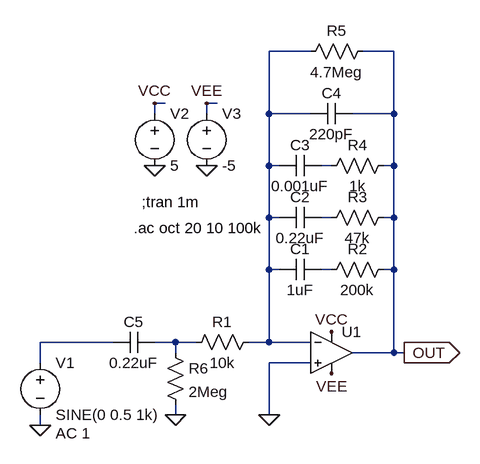
[diagram p0: schematic pink_noise2.asc]
pink_noise2.asc, the LTspice schematic file:
Version 4
SHEET 1 880 680
WIRE 368 -352 304 -352
WIRE 496 -352 448 -352
WIRE 144 -272 128 -272
WIRE 224 -272 208 -272
WIRE 128 -256 128 -272
WIRE 208 -256 208 -272
WIRE 304 -256 304 -352
WIRE 368 -256 304 -256
WIRE 496 -256 496 -352
WIRE 496 -256 432 -256
WIRE 304 -176 304 -256
WIRE 320 -176 304 -176
WIRE 400 -176 384 -176
WIRE 496 -176 496 -256
WIRE 496 -176 480 -176
WIRE 304 -96 304 -176
WIRE 320 -96 304 -96
WIRE 400 -96 384 -96
WIRE 496 -96 496 -176
WIRE 496 -96 480 -96
WIRE 304 -16 304 -96
WIRE 320 -16 304 -16
WIRE 400 -16 384 -16
WIRE 496 -16 496 -96
WIRE 496 -16 480 -16
WIRE 64 96 -48 96
WIRE 160 96 128 96
WIRE 192 96 160 96
WIRE 304 96 304 -16
WIRE 304 96 272 96
WIRE 368 96 304 96
WIRE 160 112 160 96
WIRE 496 112 496 -16
WIRE 496 112 432 112
WIRE 512 112 496 112
WIRE -48 128 -48 96
WIRE 368 128 304 128
WIRE 160 208 160 192
WIRE 304 208 304 128
WIRE -48 224 -48 208
FLAG 400 80 VCC
FLAG 400 144 VEE
FLAG -48 224 0
FLAG 128 -176 0
FLAG 208 -176 0
FLAG 128 -272 VCC
FLAG 208 -272 VEE
FLAG 304 208 0
FLAG 512 112 OUT
IOPIN 512 112 Out
FLAG 160 208 0
SYMBOL voltage -48 112 R0
WINDOW 123 24 124 Left 2
WINDOW 39 0 0 Left 2
SYMATTR InstName V1
SYMATTR Value SINE(0 0.5 1k)
SYMATTR Value2 AC 1
SYMBOL res 288 80 R90
WINDOW 0 0 56 VBottom 2
WINDOW 3 32 56 VTop 2
SYMATTR InstName R1
SYMATTR Value 10k
SYMBOL Opamps\\UniversalOpamp2 400 112 R0
SYMATTR InstName U1
SYMBOL cap 384 -32 R90
WINDOW 0 0 32 VBottom 2
WINDOW 3 32 32 VTop 2
SYMATTR InstName C1
SYMATTR Value 1uF
SYMBOL cap 384 -112 R90
WINDOW 0 0 32 VBottom 2
WINDOW 3 32 32 VTop 2
SYMATTR InstName C2
SYMATTR Value 0.22uF
SYMBOL cap 384 -192 R90
WINDOW 0 0 32 VBottom 2
WINDOW 3 32 32 VTop 2
SYMATTR InstName C3
SYMATTR Value 0.001uF
SYMBOL cap 432 -272 R90
WINDOW 0 0 32 VBottom 2
WINDOW 3 32 32 VTop 2
SYMATTR InstName C4
SYMATTR Value 220pF
SYMBOL res 496 -32 R90
WINDOW 0 0 56 VBottom 2
WINDOW 3 32 56 VTop 2
SYMATTR InstName R2
SYMATTR Value 200k
SYMBOL res 496 -112 R90
WINDOW 0 0 56 VBottom 2
WINDOW 3 32 56 VTop 2
SYMATTR InstName R3
SYMATTR Value 47k
SYMBOL res 496 -192 R90
WINDOW 0 0 56 VBottom 2
WINDOW 3 32 56 VTop 2
SYMATTR InstName R4
SYMATTR Value 1k
SYMBOL res 464 -368 R90
WINDOW 0 0 56 VBottom 2
WINDOW 3 32 56 VTop 2
SYMATTR InstName R5
SYMATTR Value 4.7Meg
SYMBOL voltage 128 -272 R0
WINDOW 123 0 0 Left 2
WINDOW 39 0 0 Left 2
SYMATTR InstName V2
SYMATTR Value 5
SYMBOL voltage 208 -272 R0
WINDOW 123 0 0 Left 2
WINDOW 39 0 0 Left 2
SYMATTR InstName V3
SYMATTR Value -5
SYMBOL cap 128 80 R90
WINDOW 0 0 32 VBottom 2
WINDOW 3 32 32 VTop 2
SYMATTR InstName C5
SYMATTR Value 0.22uF
SYMBOL res 144 96 R0
SYMATTR InstName R6
SYMATTR Value 2Meg
TEXT 108 -120 Left 2 !;tran 1m
TEXT 96 -80 Left 2 !.ac oct 20 10 100k

The netlist it stands for:
* pink_noise2.asc
V1 N005 0 SINE(0 0.5 1k) AC 1
R1 N001 N006 10k
XU1 0 N001 VCC VEE OUT level.2 Avol=1Meg GBW=10Meg Slew=10Meg ilimit=25m rail=0 Vos=0 phimargin=45 en=0 enk=0 in=0 ink=0 Rin=500Meg  ; pins IN+ IN- V+ V- OUT
C1 N004 N001 1uF
C2 N003 N001 0.22uF
C3 N002 N001 0.001uF
C4 OUT N001 220pF
R2 OUT N004 200k
R3 OUT N003 47k
R4 OUT N002 1k
R5 OUT N001 4.7Meg
V2 VCC 0 5
V3 VEE 0 -5
C5 N006 N005 0.22uF
R6 N006 0 2Meg
;tran 1m
.ac oct 20 10 100k
.lib UniversalOpamps2.sub
.backanno
.end